# Altium schematic sheet PowerSupply.SchDoc
size 290 x 241 mm; SheetNumber: 1; SheetTotal: 4
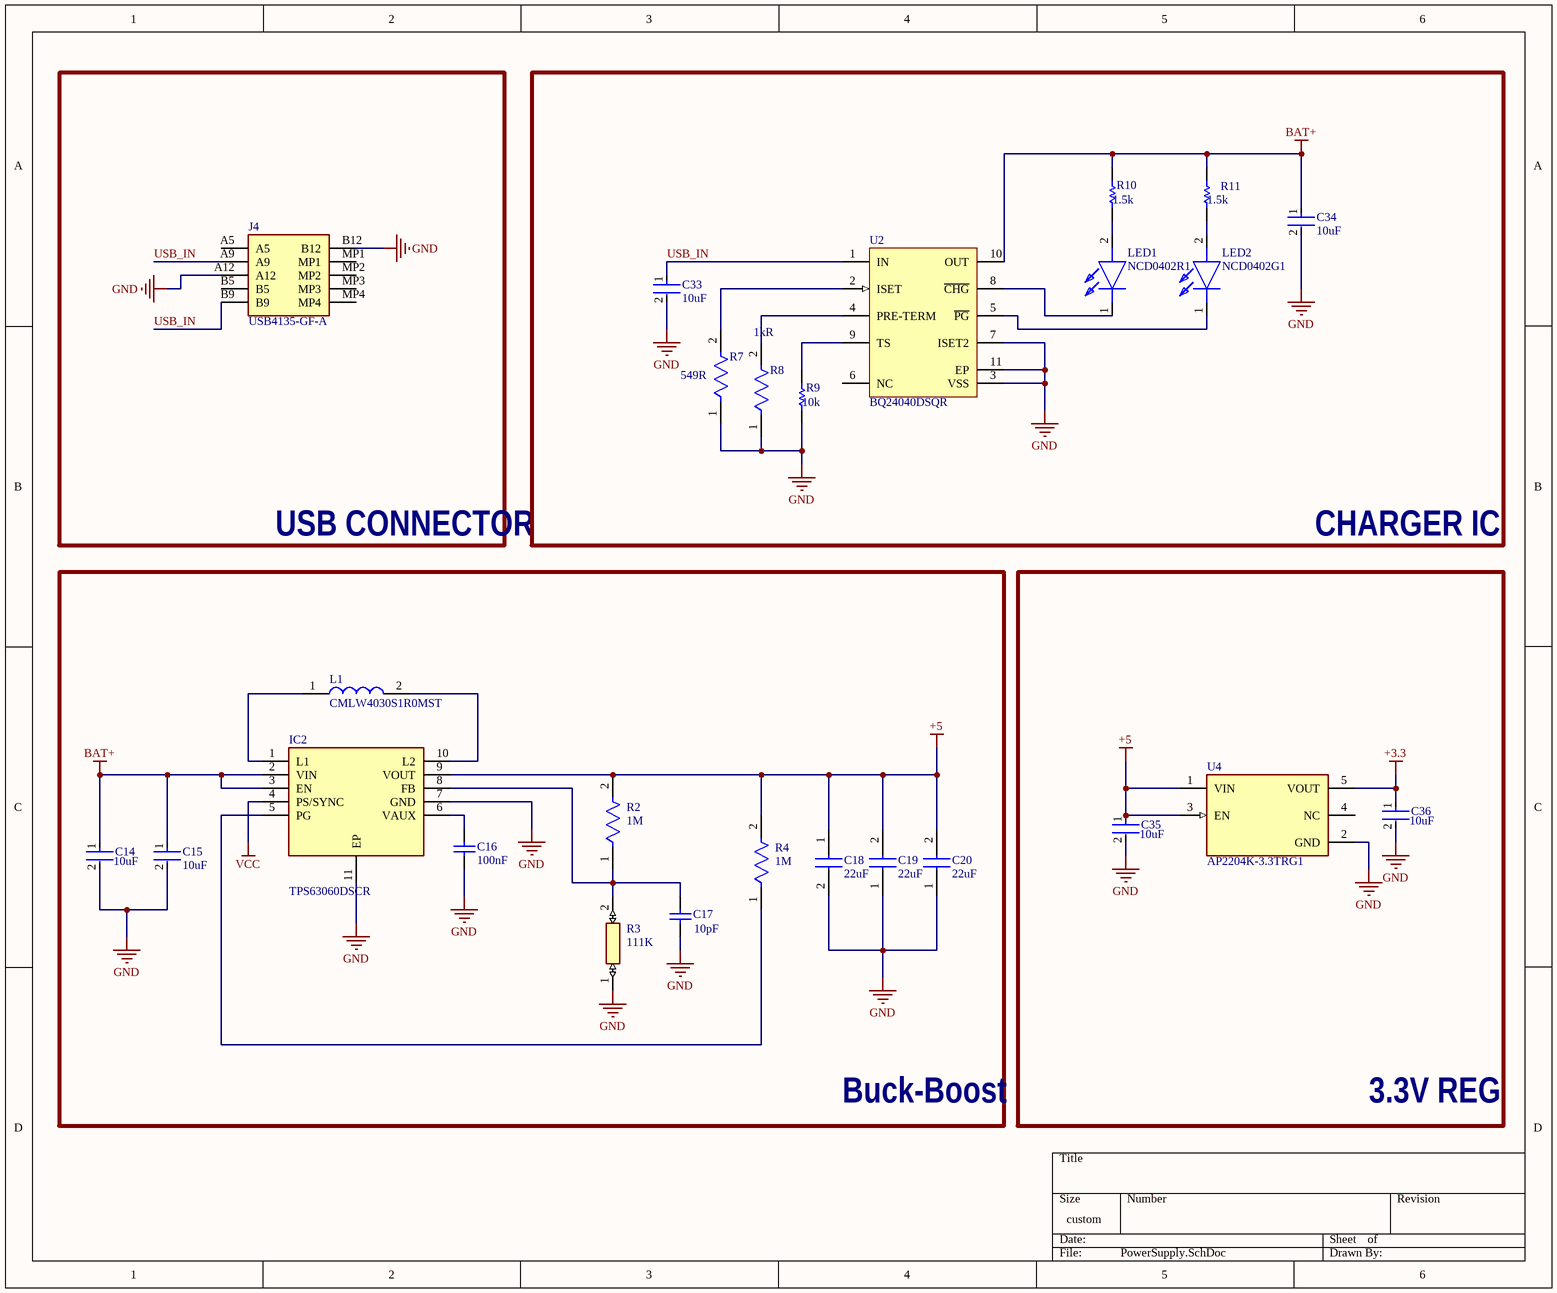
[diagram p0: PowerSupply.SchDoc]

## Parts
C14  Capacitance: 10uF  [FP-CL05A106MP5NUNC-MFG]  (hidden comment: CL05A106MP5NUNC)
C15  Capacitance: 10uF  [FP-CL05A106MP5NUNC-MFG]  (hidden comment: CL05A106MP5NUNC)
C16  Capacitance: 100nF  [CAPC1050X55X23ML05T13]  (hidden comment: CL05B104KO5NNNC)
C17  Capacitance: 10pF  [CAPC1005X55X25ML05T05]  (hidden comment: CC0402JRNPO9BN100)
C18  value 22uF  [CAPC1608X105N]  (hidden comment: CL10A226MP8NUNE)
C19  value 22uF  [CAPC1608X105N]  (hidden comment: CL10A226MP8NUNE)
C20  value 22uF  [CAPC1608X105N]  (hidden comment: CL10A226MP8NUNE)
C33  Capacitance: 10uF  [FP-CL05A106MP5NUNC-MFG]  (hidden comment: CL05A106MP5NUNC)
C34  Capacitance: 10uF  [FP-CL05A106MP5NUNC-MFG]  (hidden comment: CL05A106MP5NUNC)
C35  Capacitance: 10uF  [FP-CL05A106MP5NUNC-MFG]  (hidden comment: CL05A106MP5NUNC)
C36  Capacitance: 10uF  [FP-CL05A106MP5NUNC-MFG]  (hidden comment: CL05A106MP5NUNC)
IC2  TPS63060DSCR  [SON50P300X300X80-11N-D]
J4  USB4135-GF-A  [USB4135GFA]
L1  CMLW4030S1R0MST  [LSDPD4040WKT4R7MML]
LED1  NCD0402R1  [NCD0402R1]
LED2  NCD0402G1  [NCD0402R1]
R2  value 1M  [FP-AC0402-IPC_C]  (hidden comment: AC0402DR-071ML)
R3  value 111K  [RESC2012X60N]  (hidden comment: RT0805BRD07111KL)
R4  value 1M  [FP-AC0402-IPC_C]  (hidden comment: AC0402DR-071ML)
R7  Resistance: 549R  [FP-AC0402-IPC_B]  (hidden comment: AC0402FR-07549RL)
R8  Resistance: 1kR  [FP-RC0402-0_4-IPC_A]  (hidden comment: RC0402FR-071KL)
R9  value 10k  [RESC1005X40X25ML05T10]  (hidden comment: RC0402FR-0710KL)
R10  value 1.5k  [RESC1005X40X25ML05T10]  (hidden comment: RC0402FR-071K5L)
R11  value 1.5k  [RESC1005X40X25ML05T10]  (hidden comment: RC0402FR-071K5L)
U2  BQ24040DSQR  [DSQ0010A_V]
U4  AP2204K-3.3TRG1  [FP-SOT25-IPC_C]

## Blocks framed on the sheet
USB CONNECTOR: J4
CHARGER IC: C33 C34 LED1 LED2 R7-R11 U2
Buck-Boost: C14-C20 IC2 L1 R2-R4
3.3V REG: C35 C36 U4

## Nets
+3.3: C36.1 U4.5(VOUT)
+5: C18.1 C19.2 C20.2 C35.1 IC2.9(VOUT) R2.2 R4.2 U4.1(VIN) U4.3(EN)
BAT+: C14.1 C15.1 C34.1 IC2.2(VIN) IC2.3(EN) R10.2 R11.2 U2.10(OUT)
GND: C14.2 C15.2 C16.1 C17.1 C18.2 C19.1 C20.1 C33.2 C34.2 C35.2 C36.2 IC2.7(GND) IC2.11(EP) J4.A12 J4.B12 R3.1 R7.1 R8.1 R9.1 U2.3(VSS) U2.7(ISET2) U2.11(EP) U4.2(GND)
VCC: IC2.4(PS/SYNC)
USB_IN: C33.1 J4.A9 J4.B9 U2.1(IN)
NetC16_2: C16.2 IC2.6(VAUX)
NetC17_2: C17.2 IC2.8(FB) R2.1 R3.2
NetIC2_1: IC2.1(L1) L1.1
NetIC2_5: IC2.5(PG) R4.1
NetIC2_10: IC2.10(L2) L1.2
NetLED1_1: LED1.1(K) U2.8(~{CHG})
NetLED1_2: LED1.2(A) R10.1
NetLED2_1: LED2.1(K) U2.5(~{PG})
NetLED2_2: LED2.2(A) R11.1
NetR7_2: R7.2 U2.2(ISET)
NetR8_2: R8.2 U2.4(PRE-TERM)
NetR9_2: R9.2 U2.9(TS)

Not connected (* = marked no-connect by the designer): J4 A5 B5 MP1 MP2 MP3 MP4; U2 6(NC); U4 4(NC)

## Library data of the parts
C14 C15 C33-C36 = CMP-13271-000002-1: CAP CER 10UF 10V X5R 0402; Manufacturer: Samsung; Temperature Coefficient: 15%; Tolerance: 20%; Material: Ceramic; Octopart: https://octopart.com/cl05a106mp5nunc-samsung-22457395; Voltage Rating: 10V; RoHS: TRUE; Value: 10uF; Height: 0.7mm; Digikey Description: CAP CER 10UF 10V X5R 0402; Automotive: No; Package: CL05A106MP5NUNC; Device Class L1: Passive Components; Temperature Range High: +85°C; ComponentLink2Description: Datasheet; Device Class L2: Capacitors; Temperature Characteristic: X5R; Manufacturer Part Number: CL05A106MP5NUNC; Temperature: -55°C to +85°C; ComponentLink2URL: http://www.samsungsem.com/kr/support/product-search/mlcc/__icsFiles/afieldfile/2019/05/10/19-CL05A106MP5NUNC.pdf; Device Class L3: Ceramic Capacitors; Category: Cap; Temperature Range Low: -55°C; Ipc Land Pattern Name: CAPC10050X50; Lead Free: Yes
C16 = CMP-2000-05439-1: Chip Capacitor, 100 nF, +/- 10%, 16 V, -55 to 125 degC, 0402 (1005 Metric), RoHS, Tape and Reel; Manufacturer: Samsung Electro-Mechanics; Dielectric: X7R; Rated Voltage: 16V; Case Size/Dimension: 0402; Tolerance (%): ±10%; Manufacturer URL: http://www.samsungsem.com/global/index.jsp; Datasheet URL: https://datasheet.ciiva.com/29198/458718-da-01-en-vs-kondensator-0402-29198423.pdf; Datasheet Version: Nov-10
C17 = CMP-2100-03589-1: Chip Capacitor, 10 pF, +/- 5%, 50 V, -55 to 125 degC, 0402 (1005 Metric), RoHS, Tape and Reel; Manufacturer: Yageo; Insulation Resistance: 100GR; Voltage Rating (DC): 50V; Dielectric Material: Ceramic; Temperature Coefficient: 30ppm/degC; Dielectric: C0G; Termination: SMD/SMT; Package Reference: 0402; Lead Free: LeadFree; Composition: Ceramic; Tolerance: 5%; Case Code (Metric): 1005; Voltage Rating: 50V; Packaging: TapeandReel; Manufacturer URL: http://www.yageo.com/; REACH SVHC: NoSVHC; Max Operating Temperature: 125degC; Length: 1mm; Mount: SurfaceMount; Depth: 0.5mm; Min Operating Temperature: -55degC; Number of Pins: 2; Width: 0.02inch; Datasheet Version: Rev. 14, 07/2016; Package Quantity: 1; Datasheet URL: http://www.yageo.com/documents/recent/UPY-GP_NP0_16V-to-50V_14.pdf; Case Code (Imperial): 0402; RoHSCompliant: True; Radiation Hardening: No; Height: 0.5mm; Case/Package: 0402; Thickness: 0.022inch; Package Description: 2-Pin Surface Mount Device, Body 1 x 0.5 mm; Voltage: 50V
C18-C20 = CL10A226MP8NUNE: Capacitor; Manufacturer_Name: SAMSUNG; Datasheet Link: https://datasheet.datasheetarchive.com/originals/distributors/Datasheets-DGA10/2407063.pdf; Height: 1.05mm; Manufacturer_Part_Number: CL10A226MP8NUNE; Mouser Part Number: 187-CL10A226MP8NUNE; Mouser Price/Stock: https://www.mouser.co.uk/ProductDetail/Samsung-Electro-Mechanics/CL10A226MP8NUNE?qs=gRKWieUq2Hb5O0PTfRKzDQ%3D%3D; Arrow Part Number: CL10A226MP8NUNE; Arrow Price/Stock: https://www.arrow.com/en/products/cl10a226mp8nune/samsung-electro-mechanics?region=nac
IC2 = TPS63060DSCR: Integrated Circuit; Manufacturer_Name: Texas Instruments; Datasheet Link: http://www.ti.com/lit/gpn/tps63060; Height: 0.8mm; Manufacturer_Part_Number: TPS63060DSCR; Mouser Part Number: 595-TPS63060DSCR; Mouser Price/Stock: https://www.mouser.co.uk/ProductDetail/Texas-Instruments/TPS63060DSCR?qs=3jfYfyvUSwA68pYl7mRJ2w%3D%3D; Arrow Part Number: TPS63060DSCR; Arrow Price/Stock: https://www.arrow.com/en/products/tps63060dscr/texas-instruments?region=nac
J4 = USB4135-GF-A: Connector; Manufacturer_Name: GCT (GLOBAL CONNECTOR TECHNOLOGY); Datasheet Link: https://ar.mouser.com/datasheet/2/837/usb4135-2930399.pdf; Height: 3.5mm; Manufacturer_Part_Number: USB4135-GF-A; Mouser Part Number: 640-USB4135-GF-A; Mouser Price/Stock: https://www.mouser.co.uk/ProductDetail/GCT/USB4135-GF-A?qs=Li%252BoUPsLEnt6HRo6RUvaXA%3D%3D
L1 = LSDPD4040WKT4R7MML: Inductor; Manufacturer_Name: TAIYO YUDEN; Datasheet Link: https://media.digikey.com/pdf/Data%20Sheets/Taiyo%20Yuden%20PDFs%20URL%20links/LSDPD4040WKT4R7MM_SS.pdf; Height: 2mm; Manufacturer_Part_Number: LSDPD4040WKT4R7MML; Mouser Part Number: 963-LSDPD4040WKT4R7M; Mouser Price/Stock: https://www.mouser.co.uk/ProductDetail/TAIYO-YUDEN/LSDPD4040WKT4R7MML?qs=Jm2GQyTW%2FbhVoj%252BXZeW%2FKw%3D%3D; Supplier 1: LCSC; Supplier Part Number 1: C2685723
LED1 = NCD0402R1: LED; Manufacturer_Name: Foshan NationStar Optoelectronics; Datasheet Link: https://datasheet.lcsc.com/lcsc/2008201033_Foshan-NationStar-Optoelectronics-NCD0402R1_C130719.pdf; Height: 0.45mm; Manufacturer_Part_Number: NCD0402R1
LED2 = NCD0402R1: LED  NCD0402G1; Manufacturer_Name: Foshan NationStar Optoelectronics; Datasheet Link: https://datasheet.lcsc.com/lcsc/2008201033_Foshan-NationStar-Optoelectronics-NCD0402R1_C130719.pdf; Height: 0.45mm; Manufacturer_Part_Number: NCD0402R1
R2 R4 = CMP-03412-044987-1: RES 1MΩ ±0.5% 0.063W 0402
R3 = RT0805BRD07111KL: Resistor; Manufacturer_Name: KEMET; Datasheet Link: https://componentsearchengine.com/Datasheets/1/RT0805BRD07111KL.pdf; Height: 0.6mm; Manufacturer_Part_Number: RT0805BRD07111KL; Mouser Part Number: 603-RT0805BRD07111KL; Mouser Price/Stock: https://www.mouser.co.uk/ProductDetail/Yageo/RT0805BRD07111KL?qs=bQfrgN9vNvxW8OaJGLTFCQ%3D%3D; Arrow Part Number: RT0805BRD07111KL; Arrow Price/Stock: https://www.arrow.com/en/products/rt0805brd07111kl/yageo
R7 = CMP-03412-030313-2: RES 549Ω ±1% 0.063W 0402; Temperature Coefficient: 100ppm/°C; Max Power Dissipation: 63mW; Min Operating Temperature: -55°C; Number of Terminations: 2; Height: 0.015inch; Series: AC; Width: 0.02inch; Packaging: Tape and Reel; RoHS Compliant: Yes; Resistor Type: Thick Film; Features: Moisture Resistant; Tolerance: 1%; Max Operating Temperature: 155°C; Case/Package: 0402; Length: 0.039inch
R8 = CMP-2002-07472-3: RES 1K OHM 1% 1/16W 0402; Max Power Dissipation: 63mW; Voltage Rating (DC): 50V; Temperature Coefficient: 100ppm/°C; Power Rating: 62.5mW; Technology: THICK FILM; Size Code: 0402; Series: RC; Length: 1mm; Case/Package: 0402; Features: Moisture Resistant; Termination: SMD/SMT; Case Code (Metric): 1005; Reach SVHC Compliant: Yes; Number of Terminations: 2; Tolerance: 1%; Lead Free: Lead Free; Military Standard: Not; Resistor Type: Thick Film; Max Operating Temperature: 155°C; RoHS Compliant: Yes; Construction: Rectangular; Voltage Rating: 50V; Packaging: Tape and Reel; Height: 0.32mm; Number of Pins: 2; Resistance Tolerance: 1%; Case Code (Imperial): 0402; Depth: 0.5mm; Min Operating Temperature: -55°C; Width: 0.5mm
R9 = CMP-2002-07353-1: Manufacturer: Yageo / Phycomp; Part Number: RC0402FR-0710KL
R10 R11 = CMP-2002-07464-1: Manufacturer: Yageo / Phycomp; Part Number: RC0402FR-071K5L
U2 = CMP-0321-00456-2: 800 mA, Single-Input, Single Cell Li-Ion Battery Charger with Auto Start. Vovp=6.6 V, 3.5 V, -40 to 85 degC, 10-pin SON (DSQ), Green (RoHS & no Sb/Br); Manufacturer: Texas Instruments; NiCd: N; Vin(Min)(V): 3.5; SubFamily: Battery Charge Management; PackageDescription: 10-Pin Plastic Small Outline No-Lead, 2 x 2 x 0.8 mm Body, 0.4 mm Pitch, Exposed Pad; PackageVersion: revB, Apr-2010; Mounting Technology: Surface Mount; Eco-Plan: Green (RoHS & no Sb/Br); ComponentLink1URL: http://www.ti.com/general/docs/lit/getliterature.tsp?genericPartNumber=BQ24040&fileType=pdf; PartNumber: BQ24040DSQR; DatasheetVersion: SLUS941A; Over Voltage Protection: N; PackageReference: DSQ0010A; NiMH: N; Li-Ion: N; Lead Acid: N; Li-Polymer: N; ComponentLink1Description: Datasheet
U4 = CMP-2000-05782-2: IC REG LINEAR 3.3V 150MA SOT23-5; Max Input Voltage: 24V; Min Input Voltage: 2.3V; Quiescent Current: 50uA; Number of Regulators: 1; Max Output Current: 250mA; Reference Voltage: 1.24V; Output Type: Fixed; Polarity: Positive; Dropout Voltage: 360mV; Weight: 0.001058oz; Min Operating Temperature: -40°C; Output Current: 150mA; Lead Free: Lead Free; Length: 3.02mm; Height: 1.3mm; Width: 1.7mm; Case/Package: SOT-23-5; Max Operating Temperature: 85°C; Package Quantity: 3000; Mount: Surface Mount; Output Voltage: 3.3V; Number of Pins: 5; Packaging: Tape and Reel; Number of Outputs: 1